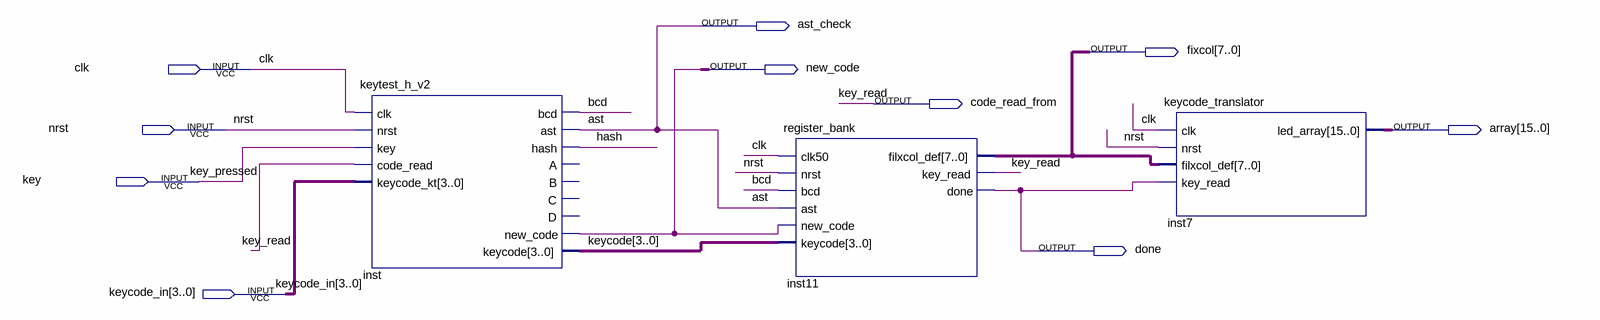
[diagram p0: schematic sheet]
// Quartus schematic translator_sim.bdf as structural Verilog: 3 symbols, 10 pins
module translator_sim (
  input  clk,
  input  nrst,
  input  key,
  input  [3:0] keycode_in,
  output ast_check,
  output [7:0] fixcol,
  output new_code,
  output code_read_from,
  output [15:0] array,
  output done
);

  wire bcd, hash;
  wire [3:0] keycode;

  keytest_h_v2 inst (
    .clk(clk), .nrst(nrst), .key(key), .code_read(code_read_from), .keycode_kt(keycode_in), .bcd(bcd),
    .ast(ast_check), .hash(hash), .new_code(new_code), .keycode(keycode));  // open: A, B, C, D
  register_bank inst11 (
    .clk50(clk), .nrst(nrst), .bcd(bcd), .ast(ast_check), .new_code(new_code), .keycode(keycode),
    .filxcol_def(fixcol), .key_read(code_read_from), .done(done));
  keycode_translator inst7 (.clk(clk), .nrst(nrst), .filxcol_def(fixcol), .key_read(done), .led_array(array));

  // Other names for the same wires on the sheet: ast = ast_check; key_pressed = key; key_read = code_read_from
endmodule
